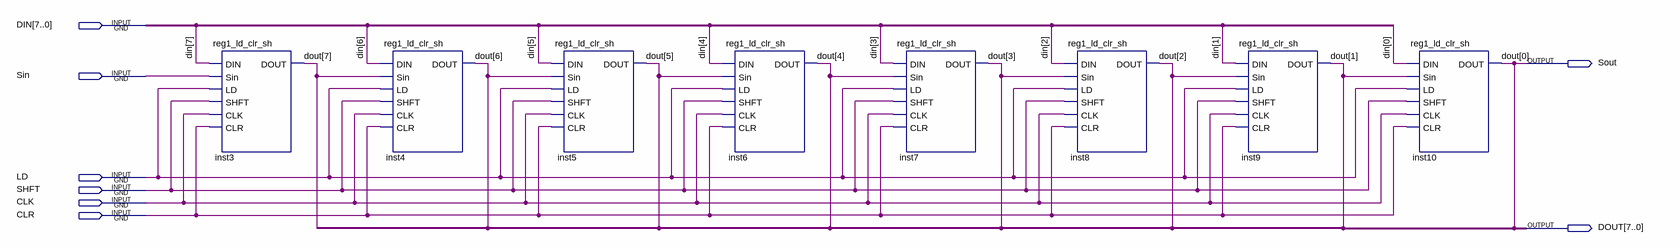
[diagram p0: schematic sheet]
// Quartus schematic reg8_ld_clr_sh.bdf as structural Verilog: 8 symbols, 8 pins
module reg8_ld_clr_sh (
  input  [7:0] DIN,
  input  Sin,
  input  LD,
  input  SHFT,
  input  CLK,
  input  CLR,
  output Sout,
  output [7:0] DOUT
);

  reg1_ld_clr_sh inst3 (.DIN(DIN[7]), .LD(LD), .Sin(Sin), .SHFT(SHFT), .CLK(CLK), .CLR(CLR), .DOUT(DOUT[7]));
  reg1_ld_clr_sh inst4 (.DIN(DIN[6]), .LD(LD), .Sin(DOUT[7]), .SHFT(SHFT), .CLK(CLK), .CLR(CLR), .DOUT(DOUT[6]));
  reg1_ld_clr_sh inst5 (.DIN(DIN[5]), .LD(LD), .Sin(DOUT[6]), .SHFT(SHFT), .CLK(CLK), .CLR(CLR), .DOUT(DOUT[5]));
  reg1_ld_clr_sh inst6 (.DIN(DIN[4]), .LD(LD), .Sin(DOUT[5]), .SHFT(SHFT), .CLK(CLK), .CLR(CLR), .DOUT(DOUT[4]));
  reg1_ld_clr_sh inst7 (.DIN(DIN[3]), .LD(LD), .Sin(DOUT[4]), .SHFT(SHFT), .CLK(CLK), .CLR(CLR), .DOUT(DOUT[3]));
  reg1_ld_clr_sh inst8 (.DIN(DIN[2]), .LD(LD), .Sin(DOUT[3]), .SHFT(SHFT), .CLK(CLK), .CLR(CLR), .DOUT(DOUT[2]));
  reg1_ld_clr_sh inst9 (.DIN(DIN[1]), .LD(LD), .Sin(DOUT[2]), .SHFT(SHFT), .CLK(CLK), .CLR(CLR), .DOUT(DOUT[1]));
  reg1_ld_clr_sh inst10 (.DIN(DIN[0]), .LD(LD), .Sin(DOUT[1]), .SHFT(SHFT), .CLK(CLK), .CLR(CLR), .DOUT(DOUT[0]));

  assign Sout = DOUT[0];
endmodule
